# EAGLE schematic iterasi3 (EAGLE 9.5.1)
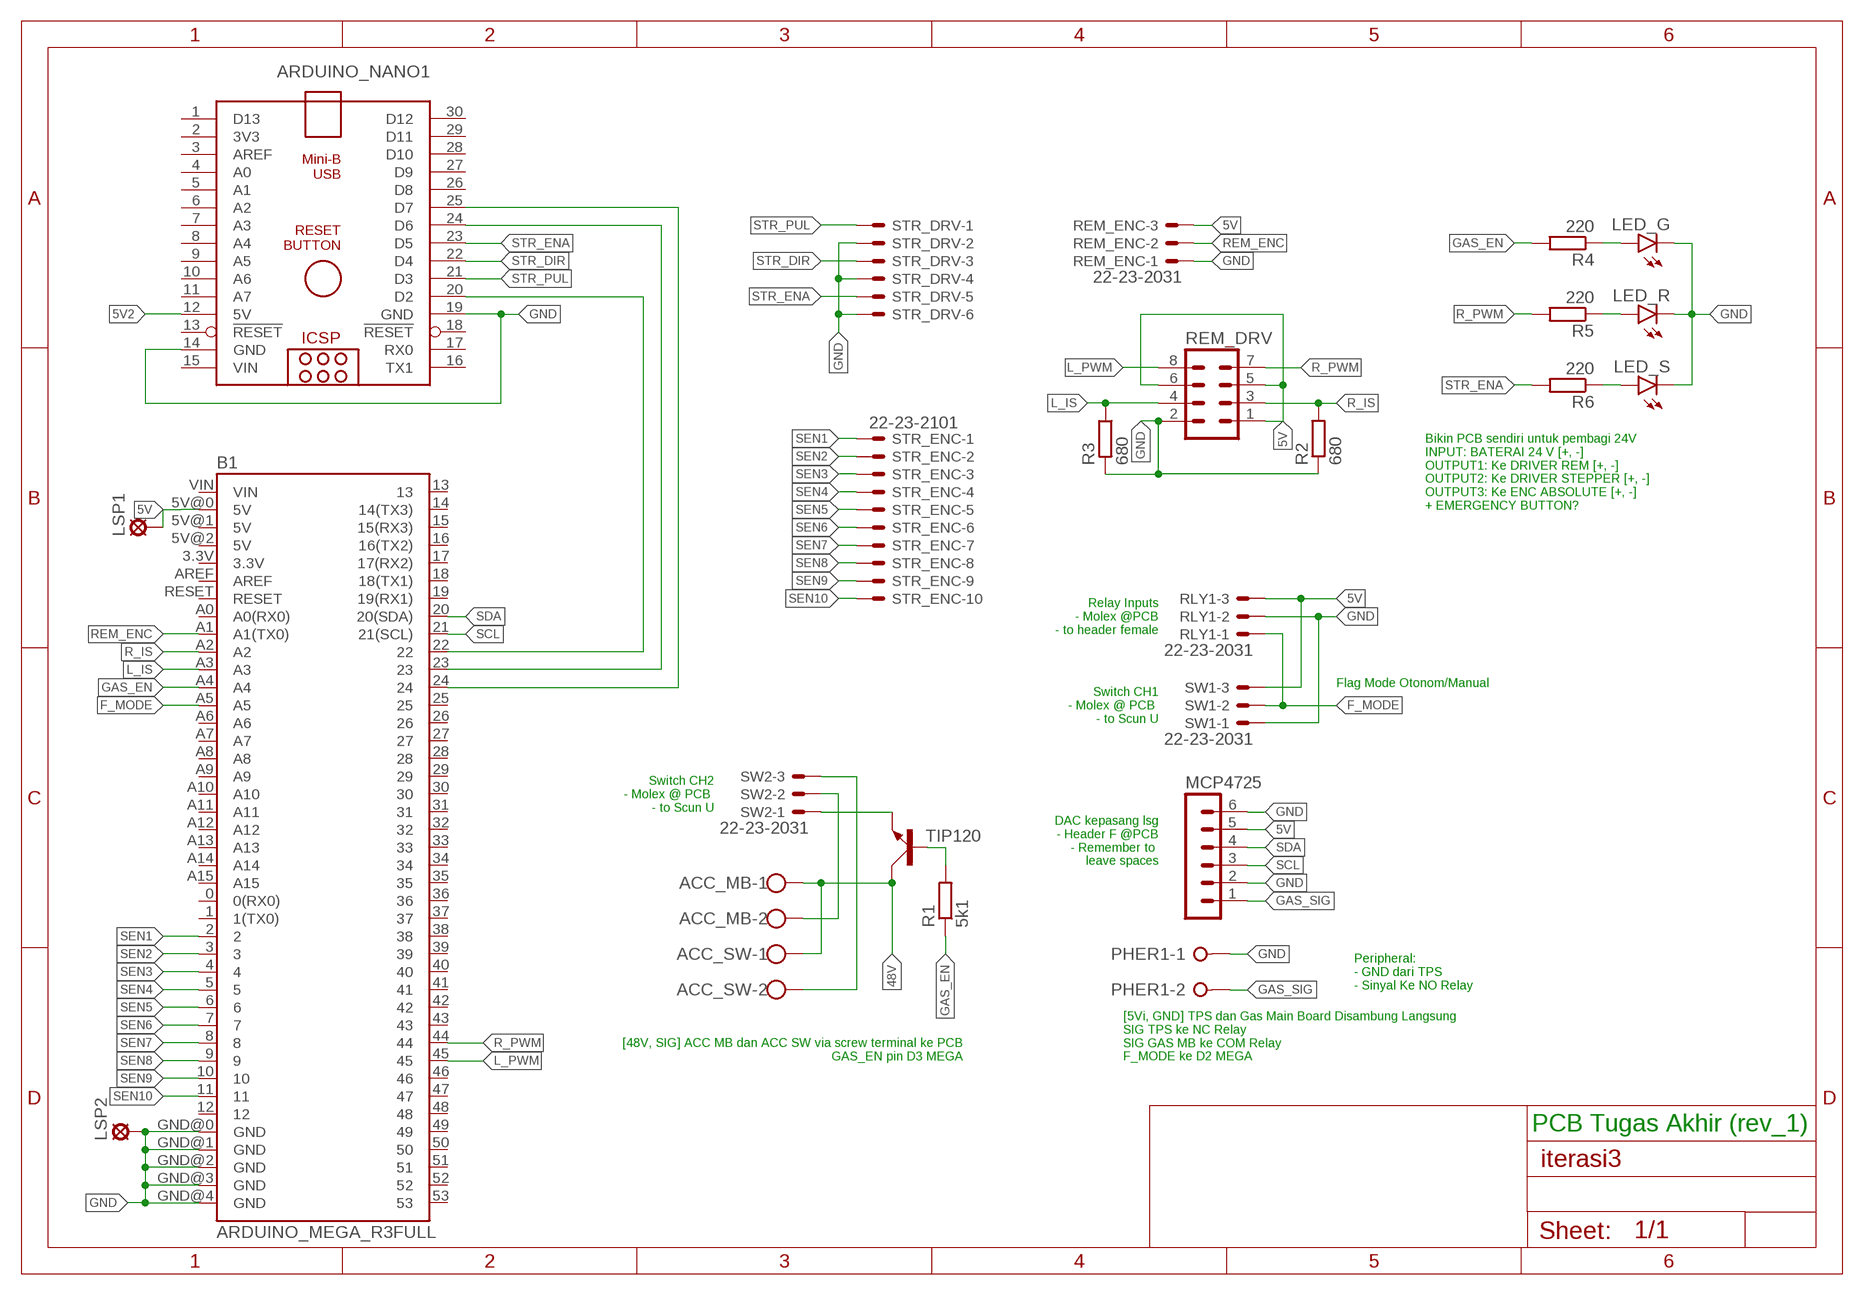
[diagram p0: schematic, sheet 1]

## Parts
ACC_MB  W237-102  [W237-102]
ACC_SW  W237-102  [W237-102]
ARDUINO_NANO1  ARDUINO_NANO  [ARDUINO_NANO]
B1  ARDUINO_MEGA_R3FULL  [ARDUINO_MEGA]
LED_G  TLLY4400  [LED3MM]
LED_R  TLLY4400  [LED3MM]
LED_S  TLLY4400  [LED3MM]
LSP1  SE13  [SE13]
LSP2  SE13  [SE13]
MCP4725  MA06-1  [MA06-1]
PHER1  GND_TPS/RELAY_NO  W237-02P  [W237-132]
R1  5k1  R-EU_0207/10  [0207/10]
R2  680  R-EU_0207/10  [0207/10]
R3  680  R-EU_0207/10  [0207/10]
R4  220  R-EU_0207/10  [0207/10]
R5  220  R-EU_0207/10  [0207/10]
R6  220  R-EU_0207/10  [0207/10]
REM_DRV  MA04-2  [MA04-2]
REM_ENC  22-23-2031  [22-23-2031]
RLY1  22-23-2031  [22-23-2031]
STR_DRV  22-23-2061  [22-23-2061]
STR_ENC  22-23-2101  [22-23-2101]
SW1  22-23-2031  [22-23-2031]
SW2  22-23-2031  [22-23-2031]
TIP120  TIP41C  [TO220AV]

## Nets
5V: B1.5V@0(5V) LSP1.MP MCP4725.5 REM_DRV.1 REM_DRV.5 REM_DRV.6 REM_ENC.3 RLY1.3 SW1.3
5V2: ARDUINO_NANO1.12(5V)
48V [48V]: ACC_MB.1 ACC_SW.1 TIP120.C
F_MODE: B1.A5 RLY1.1 SW1.2
GAS_EN: B1.A4 R1.1 R4.2
GAS_SIG: MCP4725.1 PHER1.2
GND [GND]: ARDUINO_NANO1.14(GND) ARDUINO_NANO1.19(GND) B1.GND@0(GND) B1.GND@1(GND) B1.GND@2(GND) B1.GND@3(GND) B1.GND@4(GND) LED_G.K(C) LED_R.K(C) LED_S.K(C) LSP2.MP MCP4725.2 MCP4725.6 PHER1.1 R2.1 R3.2 REM_DRV.2 REM_ENC.1 RLY1.2 STR_DRV.2 STR_DRV.4 STR_DRV.6 SW1.1
L_IS: B1.A3 R3.1 REM_DRV.4
L_PWM: B1.45 REM_DRV.8
N$1: R1.2 TIP120.B
N$2 [48V]: SW2.1 TIP120.E
N$4 [48V]: ACC_MB.2 SW2.2
N$5 [48V]: ACC_SW.2 SW2.3
N$7: LED_G.A R4.1
N$8: LED_R.A R5.1
N$9: LED_S.A R6.1
N$10: ARDUINO_NANO1.20(D2) B1.22
N$11: ARDUINO_NANO1.24(D6) B1.23
N$12: ARDUINO_NANO1.25(D7) B1.24
R_IS: B1.A2 R2.2 REM_DRV.3
R_PWM: B1.44 R5.2 REM_DRV.7
REM_ENC: B1.A1(A1(TX0)) REM_ENC.2
SCL: B1.21(21(SCL)) MCP4725.3
SDA: B1.20(20(SDA)) MCP4725.4
SEN1: B1.2 STR_ENC.1
SEN2: B1.3 STR_ENC.2
SEN3: B1.4 STR_ENC.3
SEN4: B1.5 STR_ENC.4
SEN5: B1.6 STR_ENC.5
SEN6: B1.7 STR_ENC.6
SEN7: B1.8 STR_ENC.7
SEN8: B1.9 STR_ENC.8
SEN9: B1.10 STR_ENC.9
SEN10: B1.11 STR_ENC.10
STR_DIR: ARDUINO_NANO1.22(D4) STR_DRV.3
STR_ENA: ARDUINO_NANO1.23(D5) R6.2 STR_DRV.5
STR_PUL: ARDUINO_NANO1.21(D3) STR_DRV.1
Unconnected: ARDUINO_NANO1.1(D13) ARDUINO_NANO1.2(3V3) ARDUINO_NANO1.3(AREF) ARDUINO_NANO1.4(A0) ARDUINO_NANO1.5(A1) ARDUINO_NANO1.6(A2) ARDUINO_NANO1.7(A3) ARDUINO_NANO1.8(A4) ARDUINO_NANO1.9(A5) ARDUINO_NANO1.10(A6) ARDUINO_NANO1.11(A7) ARDUINO_NANO1.13(!RESET) ARDUINO_NANO1.16(TX1) ARDUINO_NANO1.17(RX0) ARDUINO_NANO1.18(!RESET) ARDUINO_NANO1.26(D8) ARDUINO_NANO1.27(D9) ARDUINO_NANO1.28(D10) ARDUINO_NANO1.29(D11) ARDUINO_NANO1.30(D12) B1.0(0(RX0)) B1.1(1(TX0)) B1.3.3V B1.5V@1(5V) B1.5V@2(5V) B1.12 B1.13 B1.14(14(TX3)) B1.15(15(RX3)) B1.16(16(TX2)) B1.17(17(RX2)) B1.18(18(TX1)) B1.19(19(RX1)) B1.25 B1.26 B1.27 B1.28 B1.29 B1.30 B1.31 B1.32 B1.33 B1.34 B1.35 B1.36 B1.37 B1.38 B1.39 B1.40 B1.41 B1.42 B1.43 B1.46 B1.47 B1.48 B1.49 B1.50 B1.51 B1.52 B1.53 B1.A0(A0(RX0)) B1.A6 B1.A7 B1.A8 B1.A9 B1.A10 B1.A11 B1.A12 B1.A13 B1.A14 B1.A15 B1.AREF B1.RESET B1.VIN

## Notes on the sheet
- Bikin PCB sendiri untuk pembagi 24V
  INPUT: BATERAI 24 V [+, -]
  OUTPUT1: Ke DRIVER REM [+, -]
  OUTPUT2: Ke DRIVER STEPPER [+, -]
  OUTPUT3: Ke ENC ABSOLUTE [+, -]
  + EMERGENCY BUTTON?
- Relay Inputs
  - Molex @PCB
  - to header female
- Flag Mode Otonom/Manual
- Switch CH1
  - Molex @ PCB 
  - to Scun U
- Switch CH2
  - Molex @ PCB 
  - to Scun U
- DAC kepasang lsg
  - Header F @PCB
  - Remember to 
    leave spaces
- Peripheral:
  - GND dari TPS
  - Sinyal Ke NO Relay
- [48V, SIG] ACC MB dan ACC SW via screw terminal ke PCB
  GAS_EN pin D3 MEGA
- [5Vi, GND] TPS dan Gas Main Board Disambung Langsung
  SIG TPS ke NC Relay
  SIG GAS MB ke COM Relay
  F_MODE ke D2 MEGA
- PCB Tugas Akhir (rev_1)

## Power pins joined to a net without a drawn wire
VIN: ARDUINO_NANO1.15(VIN)

## Library data of the parts
ACC_MB ACC_SW = con-wago-500:W237-102: WAGO SCREW CLAMP; MPN: 237-102; OC_FARNELL: unknown; OC_NEWARK: 70K9898
ARDUINO_NANO1 = ArduinoNanoV30:ARDUINO_NANO: Arduino Nano V3.0 Overview: The Arduino Nano is a small, complete, and breadboard-friendly board based on the ATmega328 (Arduino Nano 3.x) or ATmega168 (Arduino Nano 2.x). It has more or less the same functionality of the Arduino Duemilanove, but in a different package. It lacks only a DC power jack, and works with a Mini-B USB cable instead of a standard one. The Nano was designed and is being produced by Gravitech. Specifications: Microcontroller Atmel ATmega168 or ATmega328 Operating Voltage (logic level) 5 V Input Voltage (recommended) 7-12 V Input Voltage (limits) 6-20 V Digital I/O Pins 14 (of which 6 provide PWM output) Analog Input Pins 8 DC Current per I/O Pin 40 mA Flash Memory 16 KB (ATmega168) or 32 KB (ATmega328) of which 2 KB used by bootloader SRAM 1 KB (ATmega168) or 2 KB (ATmega328) EEPROM 512 bytes (ATmega168) or 1 KB (ATmega328) Clock Speed 16 MHz Dimensions 0.73" x 1.70" Length 45 mm Width 18 mm Weigth 5 g Power: The Arduino Nano can be powered via the Mini-B USB connection, 6-20V unregulated external power supply (pin 30), or 5V regulated external power supply (pin 27). The power source is automatically selected to the highest voltage source. Memory: The ATmega168 has 16 KB of flash memory for storing code (of which 2 KB is used for the bootloader); the ATmega328 has 32 KB, (also with 2 KB used for the bootloader). The ATmega168 has 1 KB of SRAM and 512 bytes of EEPROM (which can be read and written with the EEPROM library); the ATmega328 has 2 KB of SRAM and 1 KB of EEPROM. Input and Output: Each of the 14 digital pins on the Nano can be used as an input or output, using pinMode(), digitalWrite(), and digitalRead() functions. They operate at 5 volts. Each pin can provide or receive a maximum of 40 mA and has an internal pull-up resistor (disconnected by default) of 20-50 kOhms. In addition, some pins have specialized functions. Visit Arduino - ArduinoBoardNano <https://www.arduino.cc/en/Main/ArduinoBoardNano>
B1 = SparkFun-Boards:ARDUINO_MEGA_R3: Arduino Mega R3 ATmega2560 R3 compatible footprint. SparkFun Products: Arduino Mega 2560 R3 <https://www.sparkfun.com/products/11061>
LED_G LED_R LED_S = led:TLLY4400: Low Current (2mA) LED 3 mm Tinted Diffused Package color YELLOW Source: Data sheet <http://www.farnell.com/datasheets/391098.pdf>; MF: VISHAY SEMICONDUCTOR; OC_FARNELL: 1612439
LSP1 LSP2 = solpad:SE13: SOLDER PAD E1542, drill 1,3mm, distributor Buerklin, 07F815
MCP4725 = con-lstb:MA06-1: PIN HEADER; OC_FARNELL: unknown; OC_NEWARK: unknown
PHER1 = con-wago-508:W237-02P: WAGO SREW CLAMP; OC_FARNELL: unknown; OC_NEWARK: unknown
R1-R6 = rcl:R-EU_: RESISTOR, European symbol; SPICEPREFIX: R
REM_DRV = con-lstb:MA04-2: PIN HEADER; OC_FARNELL: unknown; OC_NEWARK: unknown
REM_ENC RLY1 SW1 SW2 = con-molex:22-23-2031: .100" (2.54mm) Center Header - 3 Pin; MF: MOLEX; MPN: 22-23-2031; OC_FARNELL: 1462950; OC_NEWARK: 30C0862
STR_DRV = con-molex:22-23-2061: .100" (2.54mm) Center Header - 6 Pin; MF: MOLEX; MPN: 22-23-2061; OC_FARNELL: 1462922; OC_NEWARK: 27C1933
STR_ENC = con-molex:22-23-2101: .100" (2.54mm) Center Header - 10 Pin; MF: MOLEX; MPN: 22-23-2101; OC_FARNELL: 1756828; OC_NEWARK: 94C0765
TIP120 = transistor-power:TIP41C: NPN TRANSISTOR

## Net classes
0 default: width 0.406 mm, clearance 0.305 mm
1 GND: width 0.813 mm, clearance 0.61 mm
2 48V: width 0.813 mm, clearance 0.61 mm